# Altium schematic sheet Status_LED_Circuit.SchDoc
size A; SheetNumber: 4; SheetTotal: 4
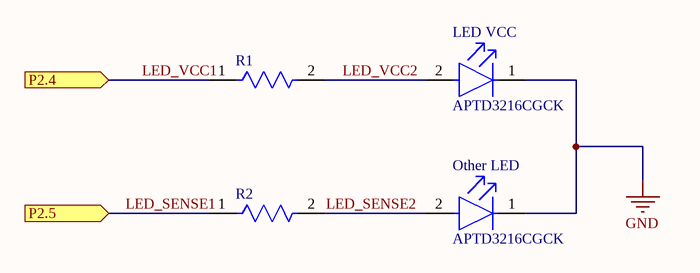
[diagram p0: Status_LED_Circuit.SchDoc]

## Parts
LED_VCC  APTD3216CGCK  [FP-APTD3216CGCK-MFG]
Other_LED  APTD3216CGCK  [FP-APTD3216CGCK-MFG]
R1  RC3216J103CS  [FP-RC3216-IPC_C]  (value not drawn)
R2  RC3216J103CS  [FP-RC3216-IPC_C]  (value not drawn)

## Ports
P2.4 (in), P2.5 (in)

## Nets
GND: LED_VCC.1(C) Other_LED.1(C)
LED_SENSE1: R2.1 ; port P2.5
LED_SENSE2: Other_LED.2(A) R2.2
LED_VCC1: R1.1 ; port P2.4
LED_VCC2: LED_VCC.2(A) R1.2

## Library data of the parts
LED_VCC Other_LED = CMP-2000-05792-2: LED GREEN CLEAR 2SMD; Forward Voltage: 2.1V; Forward Current: 20mA; Luminous Intensity: 300mcd; Number of LEDs: 1; Dominant Wavelength: 570nm; Viewing Angle: 50°; Lead Free: Lead Free; Lens Color: Clear; Mount: Surface Mount; Package Quantity: 2000; Height: 1.8mm; Number of Pins: 2; Test Current: 20mA; Case Code (Metric): 3216; Case/Package: 1206; Case Code (Imperial): 1206; Illumination Color: Green; Color: Green; Width: 1.6mm; Packaging: Tape and Reel; Min Operating Temperature: -40°C; Lens Style: Clear; Max Operating Temperature: 85°C; Length: 3.2mm
R1 R2 = CMP-13261-005388-1: Res Thick Film 1206 10kΩ 5% 0.25W ±100ppm/°C Molded SMD T/R; Resistance: 10kR; Voltage Rating (DC): 200V; Max Power Dissipation: 250mW; Case Code (Metric): 3216; Radiation Hardening: No; Contact Plating: Tin; Packaging: Tape and Reel; Case Code (Imperial): 1206; Composition: Thick Film; Height: 0.026inch; Features: Moisture Resistant; Temperature Coefficient: 100ppm/°C; Tolerance: 5%; Length: 0.126inch; Min Operating Temperature: -55°C; Depth: 1.6mm; Case/Package: 1206; Number of Terminations: 2; Width: 0.063inch; Lead Free: Lead Free; Military Standard: Not; Max Operating Temperature: 155°C